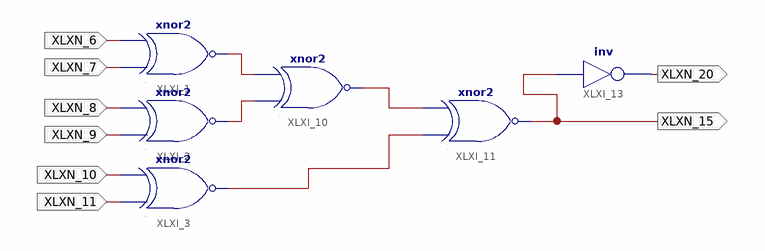
[diagram p0: schematic sheet 1]
// Xilinx ISE schematic lab5.sch (spartan6) as structural Verilog: 6 symbols, 8 ports
module lab5 (
  input  XLXN_6,
  input  XLXN_7,
  input  XLXN_8,
  input  XLXN_9,
  input  XLXN_10,
  input  XLXN_11,
  output XLXN_15,
  output XLXN_20
);

  wire XLXN_1, XLXN_3, XLXN_14, XLXN_16;

  xnor XLXI_1 (XLXN_1, XLXN_7, XLXN_6);
  xnor XLXI_2 (XLXN_3, XLXN_9, XLXN_8);
  xnor XLXI_3 (XLXN_14, XLXN_11, XLXN_10);
  xnor XLXI_10 (XLXN_16, XLXN_3, XLXN_1);
  xnor XLXI_11 (XLXN_15, XLXN_14, XLXN_16);
  not XLXI_13 (XLXN_20, XLXN_15);
endmodule
